# EAGLE design headphone_amp (EAGLE 7.2.0)
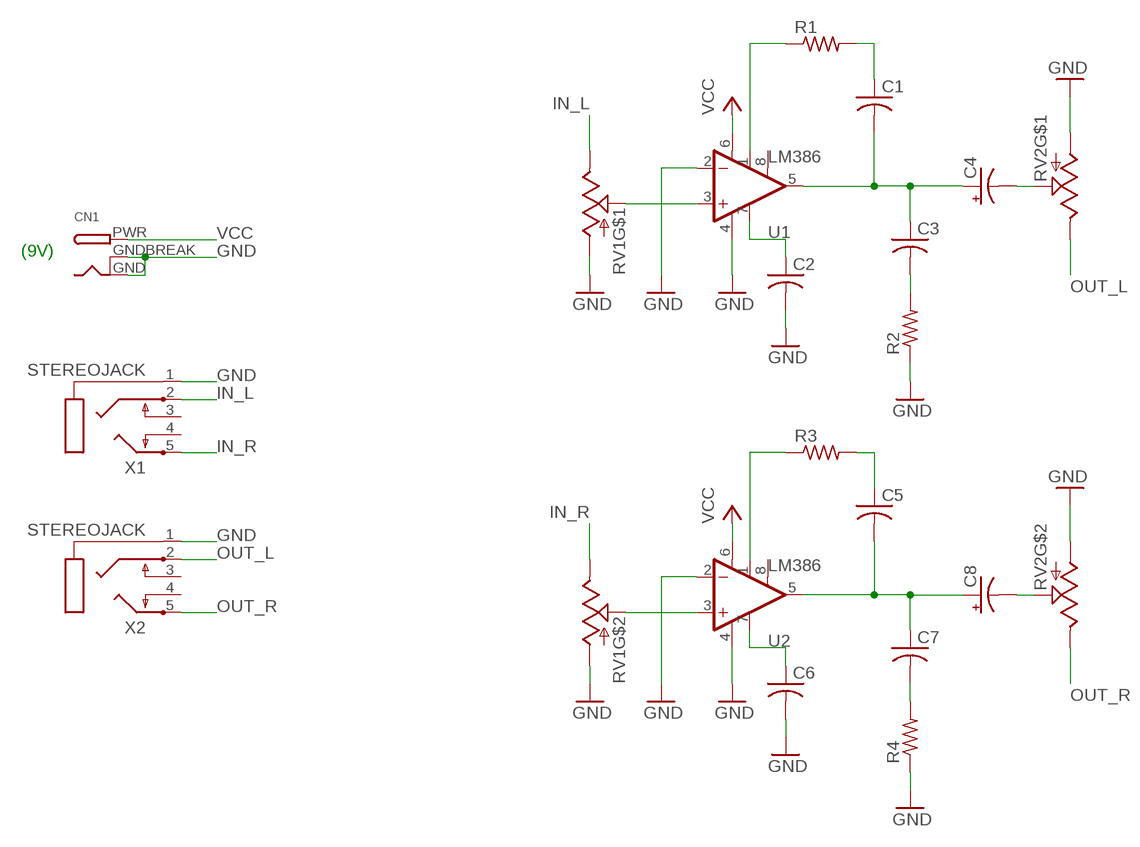
[diagram p0: schematic, sheet 1]

## Parts
C1  C-USC0805  [C0805]
C2  C-USC0805  [C0805]
C3  C-USC0805  [C0805]
C4  CPOL-US153CLV-0405  [153CLV-0405]
C5  C-USC0805  [C0805]
C6  C-USC0805  [C0805]
C7  C-USC0805  [C0805]
C8  CPOL-US153CLV-0405  [153CLV-0405]
CN1  DCBARRELPTH  [DCJACK_2MM_PTH]
R1  R-US_R0603  [R0603]
R2  R-US_R0603  [R0603]
R3  R-US_R0603  [R0603]
R4  R-US_R0603  [R0603]
RV1  POT_DUAL"  [POT_PANASONIC_DUAL_VERT]
RV2  POT_DUAL"  [POT_PANASONIC_DUAL_VERT]
U1  LM386  [DIP08]
U2  LM386  [DIP08]
X1  STEREOJACK  [STX3100]
X2  STEREOJACK  [STX3100]

## Nets
GND: C2.2 C6.2 CN1.GND CN1.GNDBREAK R2.1 R4.1 RV1.A3(A) RV1.B3(A) RV2.A3(A) RV2.B3(A) U1.2(-IN) U1.4(V-) U2.2(-IN) U2.4(V-) X1.1 X2.1
IN_L: RV1.A1(E) X1.2
IN_R: RV1.B1(E) X1.5
N$1: C2.1 U1.7(BP)
N$2: RV1.A2(S) U1.3(+IN)
N$3: R1.1 U1.1(GAIN)
N$4: C1.1 R1.2
N$5: C1.2 C3.1 C4.+ U1.5(OUT)
N$6: C3.2 R2.2
N$7: C4.- RV2.A2(S)
N$8: R3.1 U2.1(GAIN)
N$9: RV1.B2(S) U2.3(+IN)
N$10: C5.1 R3.2
N$11: C5.2 C7.1 C8.+ U2.5(OUT)
N$12: C6.1 U2.7(BP)
N$13: C7.2 R4.2
N$14: C8.- RV2.B2(S)
OUT_L: RV2.A1(E) X2.2
OUT_R: RV2.B1(E) X2.5
VCC: CN1.PWR U1.6(V+) U2.6(V+)
Unconnected: U1.8(GAIN) U2.8(GAIN) X1.3 X1.4 X2.3 X2.4

## Notes on the sheet
- (9V)

## Library data of the parts
C1-C3 C5-C7 = adafruit:C-US: CAPACITOR, American symbol
C4 C8 = adafruit:CPOL-US: POLARIZED CAPACITOR, American symbol
CN1 = adafruit:DCBARREL: 2.0mm DC Barrel Jack DCJACK_2MM_PTH - Through Hole Jack (4UConnector: 05537)
R1-R4 = adafruit:R-US_: RESISTOR, American symbol
RV1 RV2 = SparkFun-Electromechanical:POT_DUAL; DIST: digikey; DIST_ID: P2A5103-ND; PROD_ID: RES-11897
U1 U2 = SparkFun-AnalogIC:LM386: low voltage audio power amplifier
X1 X2 = adafruit:STEREOJACK: MIC/HEADPHONE JACK Stereo jack with two switches. Kycon STX3100, CUI SJ1-3555NG and/or 4UCon 05544

## Board
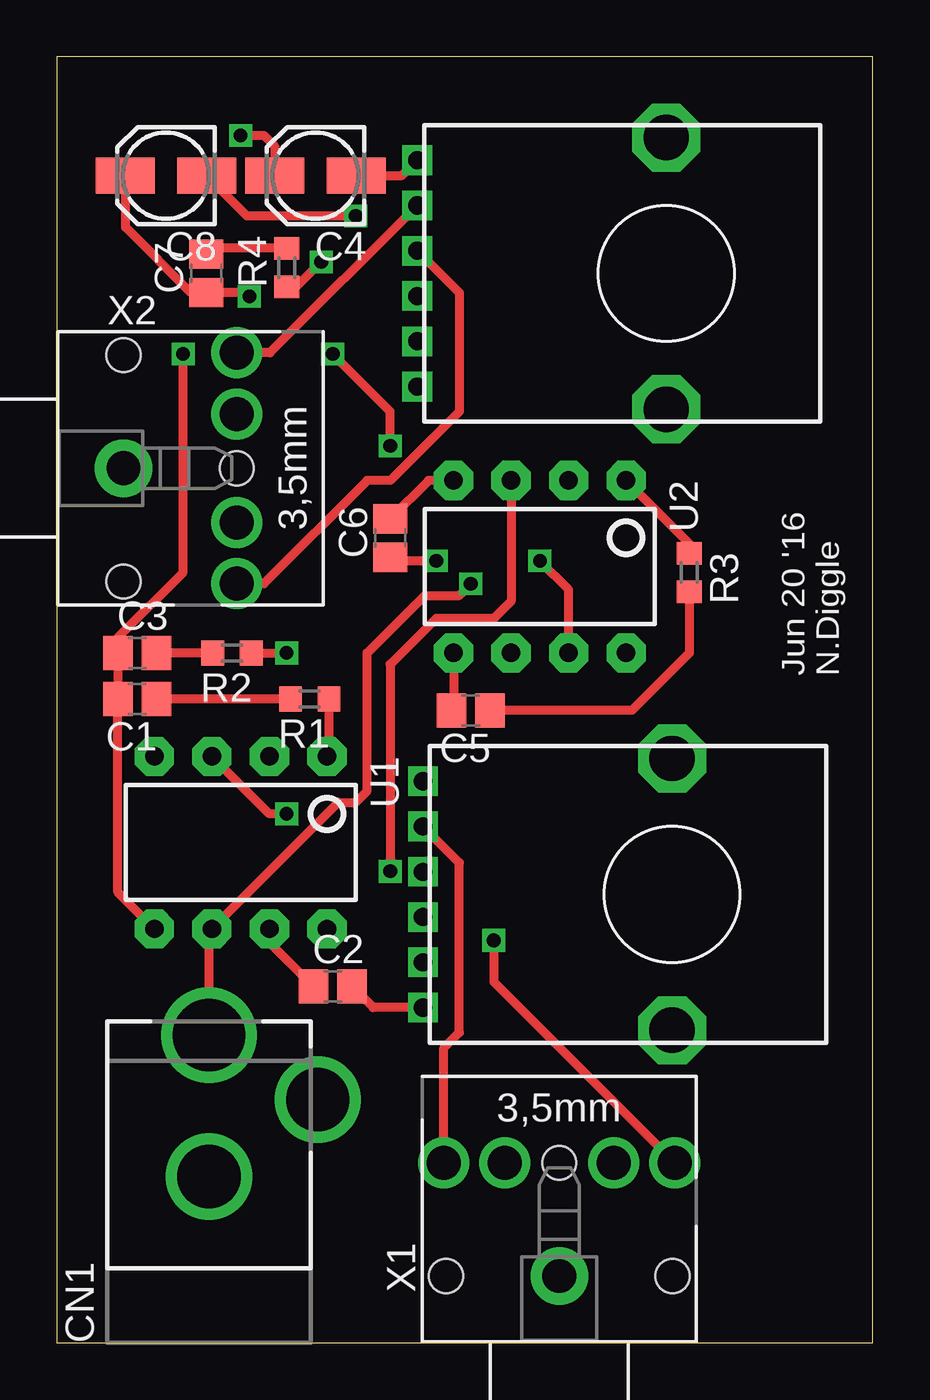
[diagram p1: board, top side]
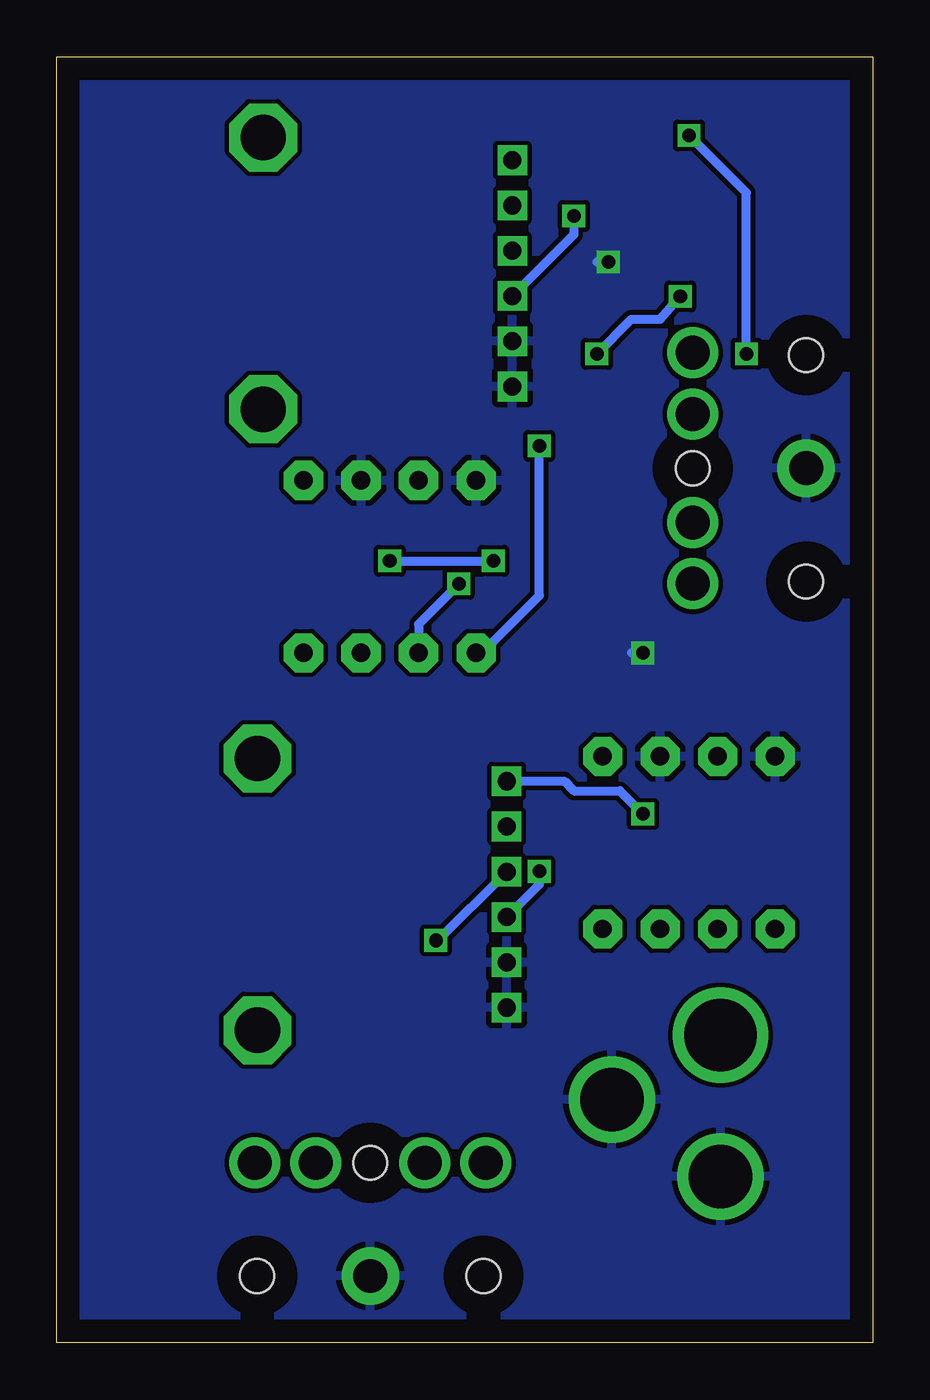
[diagram p2: board, bottom side, seen from below]

Size 36.05 x 56.82 mm. Coordinates in mm from the lower left corner, seen from the top.
Outline: 0,0 36.05,0 36.05,56.82 0,56.82 0,0
Copper layers (1*16): Top 0.035mm / dielectric 1.5mm / Bottom 0.035mm
Design rules "default": minimum track width 10mil, minimum drill 24mil, track to track 8mil, track to pad 8mil, pad to pad 8mil, via to via 8mil, smd to smd 8mil, copper to edge 40mil, drill to drill 8mil, minimum pad ring 10mil, minimum via ring 8mil, stop-mask expansion 4mil, vias tented up to drill 0mil, thermal gap 10mil

### Footprints (pad centres in the part's own frame; a part is rotated, then mirrored left to right if it is on the bottom)
C0805 = smd 1.3 x 1.5: 1 -0.85,0; 2 0.85,0
153CLV-0405 = smd 2.6 x 1.6: + 1.8,0; - -1.8,0
DCJACK_2MM_PTH = drill 2.8: GND 0,7.35; GNDBREAK 4.8,10.75 | drill 3.2: PWR 0,13.6
R0603 = smd 1 x 1.1: 1 -0.85,0; 2 0.85,0
POT_PANASONIC_DUAL_VERT = drill 0.8 square: A1 11,-3; A2 11,-5; A3 11,5; B1 11,-1; B2 11,1; B3 11,3 | drill 2 octagon: P$4 0,-6; P$5 0,6
DIP08 = drill 0.813 pad 1.727 octagon: 1 -3.81,-3.81; 2 -1.27,-3.81; 3 1.27,-3.81; 4 3.81,-3.81; 5 3.81,3.81; 6 1.27,3.81; 7 -1.27,3.81; 8 -3.81,3.81
STX3100 = drill 1.5 pad 2.54: 1 2.7,-0.1 | drill 1.5: 2 7.7,5; 3 7.7,2.3; 4 7.7,-2.5; 5 7.7,-5.2 | hole 1.5: 2.7,4.9; 2.7,-5.1; 7.7,-0.1

### Placement (x,y rotation side)
C1  3.56,28.45 180 top
C2  12.19,15.75 0 top
C3  3.56,30.48 0 top
C4  11.43,51.56 180 top
C5  18.29,27.94 180 top
C6  14.73,35.56 90 top
C7  6.6,47.24 90 top
C8  4.83,51.56 180 top
CN1  6.73,0 0 top
R1  11.18,28.45 180 top
R2  7.75,30.48 180 top
R3  27.94,34.04 270 top
R4  10.16,47.5 90 top
RV1  27.18,19.81 180 top
RV2  26.92,47.24 180 top
U1  8.13,22.1 180 top
U2  21.34,34.29 180 top
X1  22.1,0.25 90 top
X2  0.25,38.73 0 top

### Tracks (layer width: path | path; a pad name or v marks a point on that pad's centre or on a via)
GND  (via drill 0.6)
  Top 0.406: RV1.A3 13.98,14.81 C2.2 | R2.1 v10.16,30.48 | U2.4 16.42,38.1 C6.2 | R4.1 10.58,46.65 v11.68,47.75
  Bottom 0.406: v10.16,30.48 10.67,30.48 | v11.68,47.75 12.19,47.75
  pour Bottom: -0.51,-0.51 36.58,-0.51 36.58,57.4 -0.51,57.4
IN_L
  Top 0.406: RV1.A1 17.78,21.21 17.78,13.72 17.1,13.03 X1.2
IN_R  (via drill 0.6)
  Top 0.406: v19.3,17.78 19.3,15.95 X1.5
  Bottom 0.406: v19.3,17.78 19.3,17.69 RV1.B1
N$1
  Top 0.406: U1.7 9.4,17.69 C2.1
N$2  (via drill 0.6)
  Top 0.406: v10.16,23.37 9.4,23.37 U1.3
  Bottom 0.406: RV1.A2 13.64,24.81 13.21,24.38 11.18,24.38 v10.16,23.37
N$3
  Top 0.406: R1.1 12.03,26 U1.1
N$4
  Top 0.406: R1.2 C1.1
N$5  (via drill 0.6)
  Top 0.406: U1.5 2.71,19.9 C1.2 C3.1 2.71,31.15 5.59,34.04 v5.59,43.69 | v8.13,53.34 9.14,53.34 9.63,52.85 C4.+
  Bottom 0.406: v5.59,43.69 5.59,50.8 v8.13,53.34
N$6
  Top 0.406: R2.2 C3.2
N$7
  Top 0.406: C4.- 15.24,51.56 RV2.A2
N$8
  Top 0.406: U2.1 27.94,35.31 R3.1
N$9  (via drill 0.6)
  Top 0.406: U2.3 20.07,32.77 19.3,32 16.76,32 14.73,29.97 v14.73,20.83
  Bottom 0.406: v14.73,20.83 14.73,20.26 RV1.B2
N$10
  Top 0.406: R3.2 27.94,30.48 25.4,27.94 C5.1
N$11  (via drill 0.6)
  Top 0.406: U2.5 17.53,28.03 C5.2 | C8.+ 3.05,51.54 3.05,49.28 5.93,46.39 C7.1 8.34,46.39 v8.51,46.23 | v14.73,39.62 14.73,41.15 v12.19,43.69
  Bottom 0.406: U2.5 17.27,30.48 14.73,33.02 v14.73,39.62 | v12.19,43.69 10.67,45.21 9.4,45.21 v8.51,46.23
N$12  (via drill 0.6)
  Top 0.406: U2.7 22.61,33.27 v21.34,34.54 | v16.76,34.54 14.9,34.54 C6.1
  Bottom 0.406: v21.34,34.54 v16.76,34.54
N$13
  Top 0.406: R4.2 6.86,48.35 C7.2
N$14  (via drill 0.6)
  Top 0.406: C8.- 8.4,49.78 v13.21,49.78
  Bottom 0.406: v13.21,49.78 13.21,48.96 RV2.B2
OUT_L
  Top 0.406: RV2.A1 9.41,43.73 X2.2
OUT_R
  Top 0.406: RV2.B1 17.78,46.39 17.78,41.15 14.73,38.1 13.72,38.1 9.15,33.53 X2.5
VCC  (via drill 0.6)
  Top 0.406: CN1.PWR 6.73,18.16 U1.6 12.45,23.88 13.21,23.88 13.72,24.38 13.72,30.48 16.26,33.02 17.78,33.02 v18.29,33.53
  Bottom 0.406: v18.29,33.53 20.07,31.75 U2.6

### Text on the board
tNames: Jun 20 '16 / N.Diggle